# EAGLE design Grove-Base-for-ESPr-Developer (EAGLE 7.6.0)
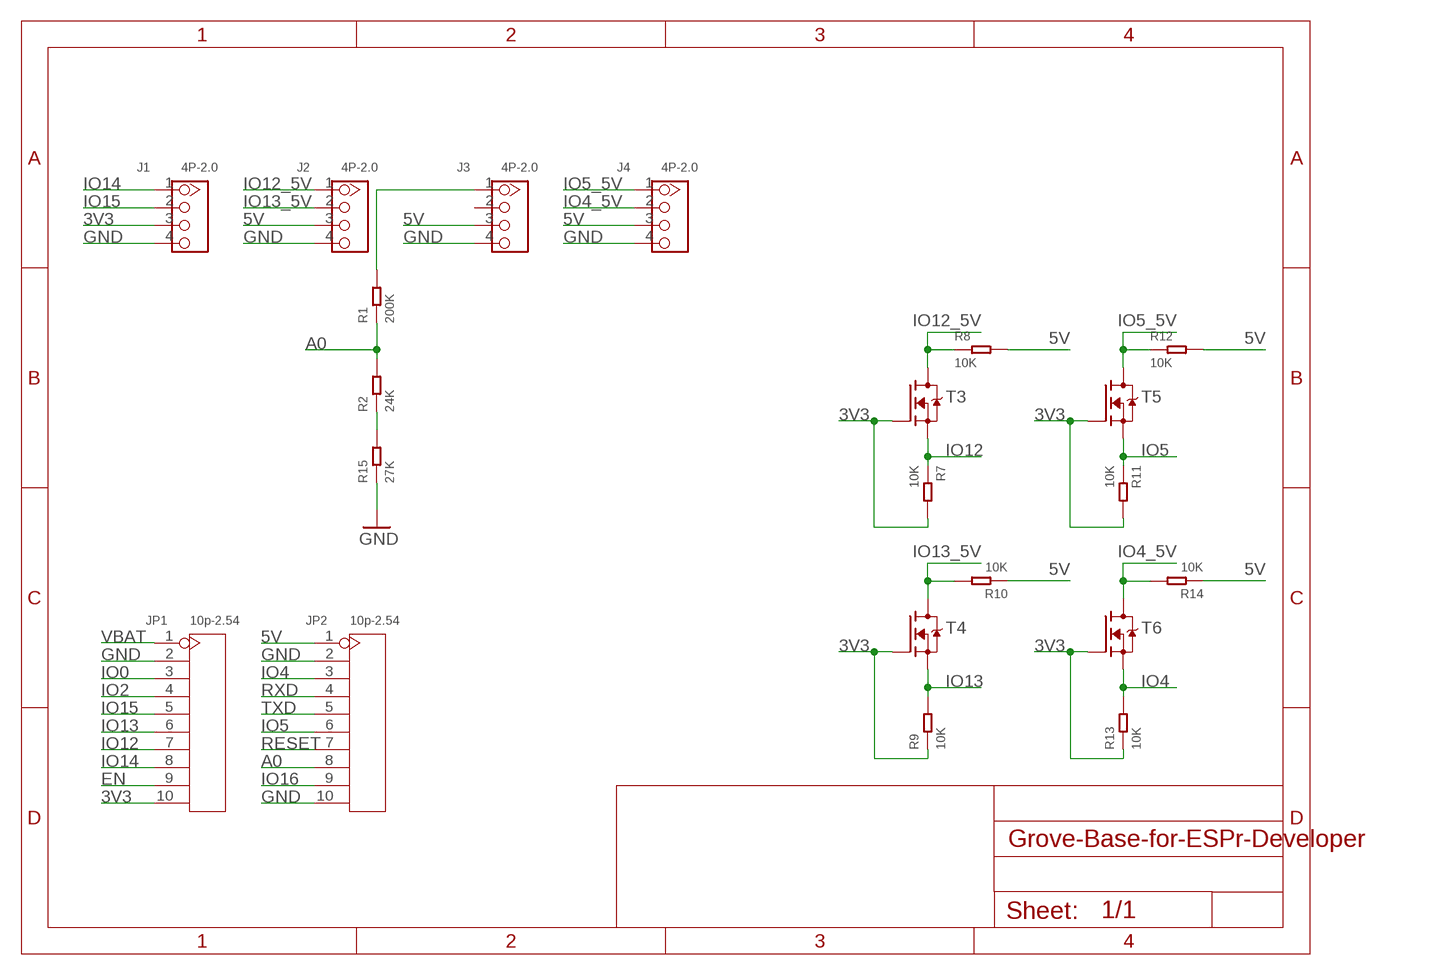
[diagram p0: schematic, sheet 1]

## Parts
J1  4P-2.0  GROVE-CONNECTOR-DIP(4P-2.0)  [HW4-2.0]
J2  4P-2.0  GROVE-CONNECTOR-DIP(4P-2.0)  [HW4-2.0]
J3  4P-2.0  GROVE-CONNECTOR-DIP(4P-2.0)  [HW4-2.0]
J4  4P-2.0  GROVE-CONNECTOR-DIP(4P-2.0)  [HW4-2.0]
JP1  10p-2.54  DIP-BLACK-MALE-HEADER-VERT(10P-2.54)  [H10-2.54]
JP2  10p-2.54  DIP-BLACK-MALE-HEADER-VERT(10P-2.54)  [H10-2.54]
R1  200K  SMD-RES-220K-1%-1/10W(0603)  [R0603]
R2  24K  SMD-RES-100K-1%-1/10W(0603)  [R0603]
R7  10K  SMD-RES-220K-1%-1/10W(0603)  [R0603]
R8  10K  SMD-RES-220K-1%-1/10W(0603)  [R0603]
R9  10K  SMD-RES-220K-1%-1/10W(0603)  [R0603]
R10  10K  SMD-RES-220K-1%-1/10W(0603)  [R0603]
R11  10K  SMD-RES-220K-1%-1/10W(0603)  [R0603]
R12  10K  SMD-RES-220K-1%-1/10W(0603)  [R0603]
R13  10K  SMD-RES-220K-1%-1/10W(0603)  [R0603]
R14  10K  SMD-RES-220K-1%-1/10W(0603)  [R0603]
R15  27K  SMD-RES-100K-1%-1/10W(0603)  [R0603]
T3  MOSFET-N-SOT23  [SOT23]
T4  MOSFET-N-SOT23  [SOT23]
T5  MOSFET-N-SOT23  [SOT23]
T6  MOSFET-N-SOT23  [SOT23]

## Nets
3V3: J1.3 JP1.10 R7.2 R9.1 R11.2 R13.1 T3.1(G) T4.1(G) T5.1(G) T6.1(G)
5V: J2.3 J3.3 J4.3 JP2.1 R8.2 R10.1 R12.2 R14.1
A0: JP2.8 R1.1 R2.2
EN: JP1.9
GND: J1.4 J2.4 J3.4 J4.4 JP1.2 JP2.2 JP2.10 R15.1
IO0: JP1.3
IO2: JP1.4
IO4: JP2.3 R13.2 T6.2(S)
IO4_5V: J4.2 R14.2 T6.3(D)
IO5: JP2.6 R11.1 T5.2(S)
IO5_5V: J4.1 R12.1 T5.3(D)
IO12: JP1.7 R7.1 T3.2(S)
IO12_5V: J2.1 R8.1 T3.3(D)
IO13: JP1.6 R9.2 T4.2(S)
IO13_5V: J2.2 R10.2 T4.3(D)
IO14: J1.1 JP1.8
IO15: J1.2 JP1.5
IO16: JP2.9
N$5: J3.1 R1.2
N$6: R2.1 R15.2
RESET: JP2.7
RXD: JP2.4
TXD: JP2.5
VBAT: JP1.1
Unconnected: J3.2

## Library data of the parts
J1-J4 = Seeed-OPL-Connector:GROVE-CONNECTOR-DIP(4P-2.0): 320110033
JP1 JP2 = Seeed-OPL-Connector:DIP-BLACK-MALE-HEADER-VERT(10P-2.54): 320020050; MPN: P125-1110A0BS116AX
R1 R7-R14 = Seeed-OPL-Resistor:SMD-RES-220K-1%-1/10W(0603): 301010685; MPN: RC0603FR-07220KL; VALUE: 220K
R2 R15 = Seeed-OPL-Resistor:SMD-RES-100K-1%-1/10W(0603): 301010196; MPN: RC0603FR-07100KL; VALUE: 100K
T3-T6 = we-transistor:MOSFET-N: N-Channel MOSFET (e.g. IRLML2502, BSS138)

## Board
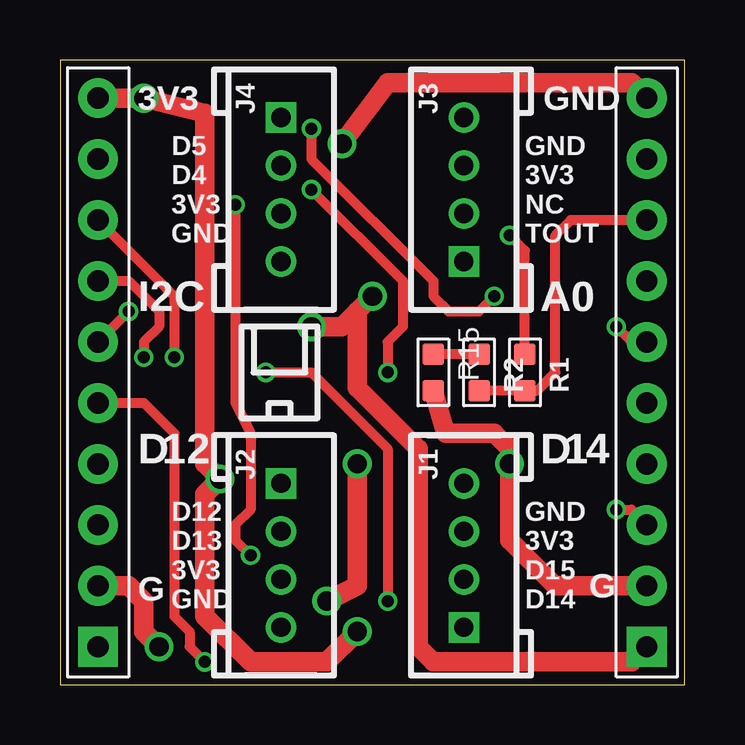
[diagram p1: board, top side]
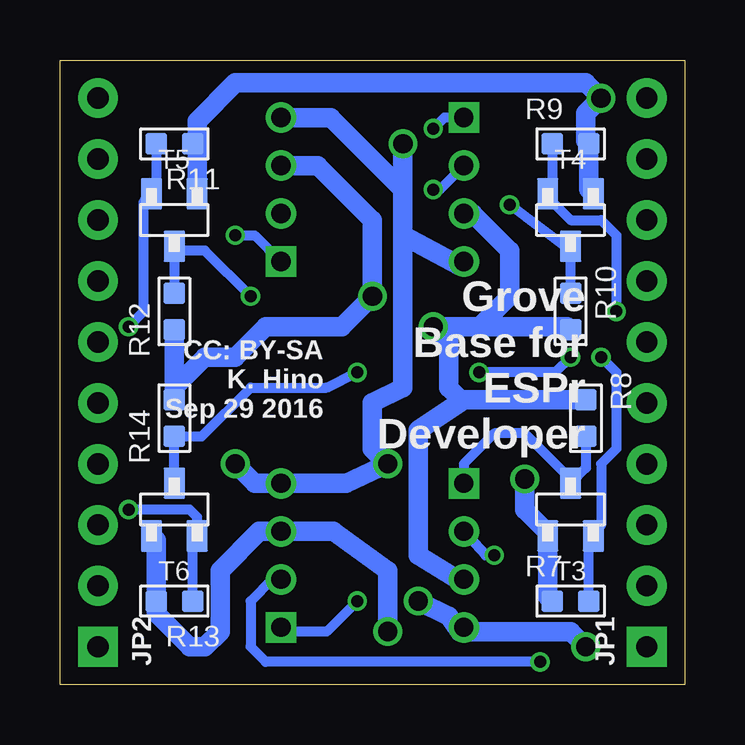
[diagram p2: board, bottom side, seen from below]

Size 26.04 x 26.04 mm. Coordinates in mm from the lower left corner, seen from the top.
Outline: 26.04,26.04 0,26.04 0,0 26.04,0.01 26.04,26.04
Copper layers (1*16): Top 0.035mm / dielectric 1.53mm / Bottom 0.035mm
Design rules "pban_5mil-l2": minimum track width 5mil, minimum drill 0.3mm, track to track 5mil, track to pad 0.229mm, pad to pad 5mil, via to via 5mil, smd to smd 5mil, copper to edge 0.5mm, drill to drill 0.5mm, minimum pad ring 0.15mm, minimum via ring 0.15mm, stop-mask expansion 4mil, vias tented up to drill 0.35mm, thermal gap 10mil

### Footprints (pad centres in the part's own frame; a part is rotated, then mirrored left to right if it is on the bottom)
HW4-2.0 = drill 0.8 pad 1.27 square: 1 -3,0 | drill 0.8 pad 1.27: 2 -1,0; 3 1,0; 4 3,0
H10-2.54 = drill 0.889 pad 1.651 square: 1 0,11.43 | drill 0.889 pad 1.651: 2 0,8.89; 3 0,6.35; 4 0,3.81; 5 0,1.27; 6 0,-1.27; 7 0,-3.81; 8 0,-6.35; 9 0,-8.89; 10 0,-11.43
R0603 = smd 0.889 x 0.889: 1 0,0.762; 2 0,-0.762
SOT23 = smd 1.3 x 0.9: 1 -1.1,0.95; 2 -1.1,-0.95; 3 1.1,0

### Placement (x,y rotation side)
J1  16.83,5.4 90 top
J2  9.21,5.4 270 top
J3  16.83,20.64 90 top
J4  9.21,20.64 270 top
JP1  1.59,13.02 180 top
JP2  24.45,13.02 180 top
R1  19.37,13.02 180 top
R2  17.46,13.02 0 top
R7  4.76,3.49 270 bottom
R8  4.13,11.11 180 bottom
R9  4.76,22.54 270 bottom
R10  4.76,15.56 180 bottom
R11  21.27,22.54 90 bottom
R12  21.27,15.56 0 bottom
R13  21.27,3.49 90 bottom
R14  21.27,11.11 0 bottom
R15  15.56,13.02 180 top
T3  4.76,7.3 90 bottom
T4  4.76,19.37 270 bottom
T5  21.27,19.37 270 bottom
T6  21.27,7.3 90 bottom

### Tracks (layer width: path | path; a pad name or v marks a point on that pad's centre or on a via)
3V3  (via drill 0.8)
  Top 0.813: JP1.10 v3.49,24.45 6.03,23.81 6.03,9.21 v6.67,8.57 6.03,7.94 6.03,2.86 7.94,0.95 11.11,0.95 v12.38,2.22
  Bottom 0.813: T5.1 20.32,22.35 | 20.32,22.35 R11.2 | 20.32,22.35 20.32,23.49 18.73,25.08 4.13,25.08 v3.49,24.45 4.13,23.81 4.13,22.67 R9.1 4,20.66 T4.1 | R7.2 5.71,3.68 T3.1 5.71,6.35 6.67,7.3 v6.67,8.57 | T6.1 22.03,6.01 R13.1 22.03,2.98 20.64,1.59 20,1.59 19.37,2.22 19.37,4.76 17.73,6.4 J1.3 14.65,6.4 12.38,4.76 v12.38,2.22
5V  (via drill 0.8)
  Top 0.813: JP2.1 23.81,0.95 15.56,0.95 14.92,1.59 14.92,9.84 12.38,12.38 12.38,15.56 v13.02,16.19 11.75,14.92 v10.48,14.92
  Bottom 0.813: R12.2 R14.1 21.27,12.38 20,13.65 18.73,13.65 17.46,14.92 14.29,14.92 v13.02,16.19 13.02,19.37 15.29,21.64 J3.3 | 8.57,14.92 v10.48,14.92 9.84,14.29 9.84,12.38 9.33,11.87 9.21,11.87 | 8.57,14.92 4.89,14.92 R10.1 | 8.57,14.92 7.3,16.19 7.3,18.1 8.84,19.64 J4.3 | R8.2 9.21,11.87 | J2.3 9.48,4.4 11.11,5.4 11.11,10.6 9.21,11.87
A0
  Top 0.406: JP2.8 21.27,19.37 20.64,18.73 20.64,13.02 19.88,12.26 R1.1 R2.2
GND  (via drill 0.8)
  Top 0.813: JP2.10 23.81,25.08 13.65,25.08 v11.75,22.54 | v4.13,1.59 3.49,2.22 3.49,3.49 2.86,4.13 JP1.2 | JP2.2 20.64,4.13 18.73,6.03 v18.73,9.21 18.73,9.84 18.1,10.48 16.07,10.48 R15.1 | v12.38,9.21 12.38,4.13 v11.11,3.49
  Bottom 0.813: v11.75,22.54 11.75,20.64 | 11.75,20.64 11.75,18.73 | 11.75,18.73 9.38,17.46 J4.4 | J3.4 14.75,23.64 11.75,20.64 | 11.75,18.73 11.75,12.38 13.02,11.75 13.02,9.84 v12.38,9.21 14.11,8.4 J1.4 17.92,8.4 v18.73,9.21 | v4.13,1.59 4.76,2.22 9.03,2.22 J2.4 9.38,2.22 9.84,2.86 v11.11,3.49
IO4  (via drill 0.5)
  Top 0.406: v23.18,7.3 23.81,7.3 JP2.3
  Bottom 0.406: R13.2 20.51,6.01 T6.2 20.32,6.99 20.64,7.3 v23.18,7.3
IO4_5V  (via drill 0.5)
  Top 0.406: v10.48,20.64 14.29,16.83 14.29,14.92 13.65,14.29 v13.65,13.02
  Bottom 0.406: T6.3 R14.2 20.13,10.35 18.1,12.38 14.92,12.38 v13.65,13.02 | v10.48,20.64 10.21,20.64 J4.2
IO5  (via drill 0.5)
  Top 0.406: JP2.6 23.81,14.29 v23.18,14.92
  Bottom 0.406: 22.54,20 22.54,20.15 T5.2 | R11.1 22.03,20.51 22.54,20 | v23.18,14.92 22.54,15.56 22.54,20
IO5_5V  (via drill 0.5)
  Top 0.406: v10.48,23.18 10.48,21.91 15.56,16.83 15.56,16.19 16.19,15.56 17.46,15.56 v18.1,16.19
  Bottom 0.406: R12.1 T5.3 21.1,18.1 20,18.1 v18.1,16.19 | J4.1 10.02,23.64 v10.48,23.18
IO12  (via drill 0.5)
  Top 0.406: JP1.7 2.86,16.83 4.13,15.56 4.13,14.92 3.49,14.29 v3.49,13.65
  Bottom 0.406: v3.49,13.65 2.86,13.02 2.86,9.84 3.49,9.21 3.49,6.67 T3.2 4,6.01 R7.1
IO12_5V
  Bottom 0.406: R8.1 4.13,9.04 T3.3 4.77,8.58 6.67,10.48 7.94,10.48 9.21,9.21 J2.1
IO13  (via drill 0.5)
  Top 0.406: v2.86,15.56 JP1.6
  Bottom 0.406: R9.2 5.52,20.66 T4.2 5.71,20.32 4.76,19.37 3.49,19.37 2.86,18.73 v2.86,15.56
IO13_5V  (via drill 0.5)
  Top 0.406: v7.3,20 7.3,11.75 7.94,10.48 7.94,7.3 7.3,6.67 7.3,6.03 v7.94,5.4
  Bottom 0.406: 4.76,18.1 T4.3 | R10.2 4.76,18.1 | 4.76,18.1 v7.3,20 | v7.94,5.4 8.3,5.4 J2.2
IO14  (via drill 0.5)
  Top 0.406: JP1.8 4.76,16.19 v4.76,13.65 | v8.57,13.02 10.48,13.02 13.65,9.84 v13.65,3.49
  Bottom 0.406: v4.76,13.65 5.4,13.02 v8.57,13.02 | v13.65,3.49 14.92,2.22 16.65,2.22 J1.1
IO15  (via drill 0.5)
  Top 0.406: JP1.5 3.49,11.75 4.76,10.48 4.76,2.86 5.4,2.22 5.4,1.59 v6.03,0.95
  Bottom 0.406: J1.2 17.19,4.4 18.1,3.49 18.1,1.59 17.46,0.95 v6.03,0.95
N$5  (via drill 0.5)
  Top 0.406: R1.2 19.37,18.1 v18.73,18.73
  Bottom 0.406: v18.73,18.73 17.92,18.73 J3.1
N$6
  Top 0.406: R2.1 R15.2

### Text on the board
tNames: 3V3 | GND | D5 / D4 / 3V3 / GND | GND / 3V3 / NC / TOUT | I2C | A0 | D | 1 | 2 | D | 1 | 4 | G | D12 / D13 / 3V3 / GND | GND / 3V3 / D15 / D14 | G
bNames: Grove / Base for / ESPr / Developer | CC: BY-SA / K. Hino / Sep 29 2016